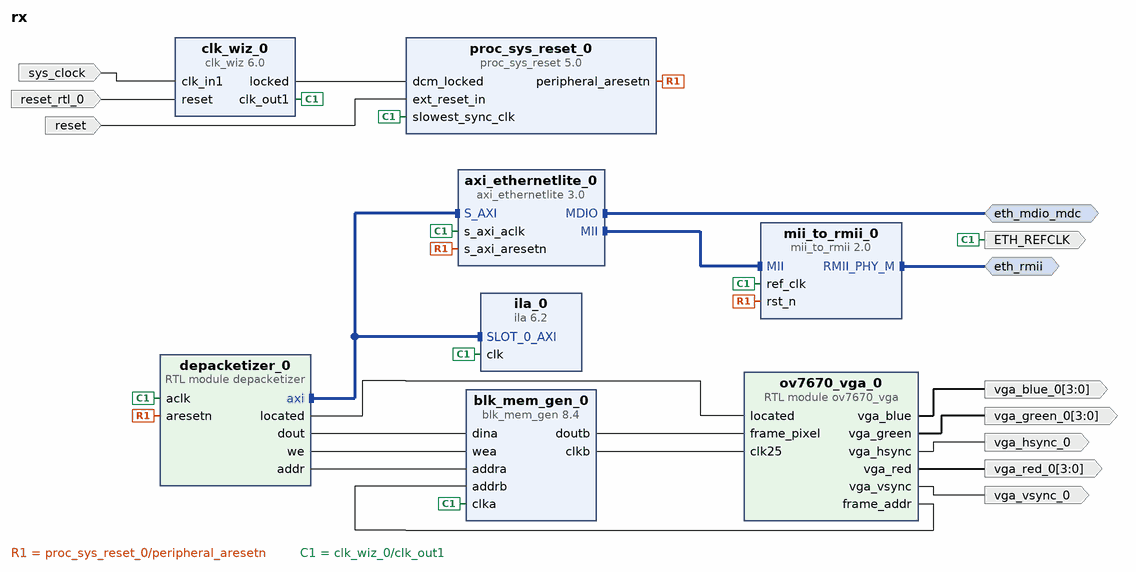
[diagram p0: block diagram of the top level]
# Vivado block design rx, xc7a100tcsg324-1, Vivado 2018.3
create_bd_design rx

create_bd_intf_port -mode Master -vlnv xilinx.com:interface:mdio_rtl:1.0 eth_mdio_mdc
create_bd_intf_port -mode Master -vlnv xilinx.com:interface:rmii_rtl:1.0 eth_rmii
create_bd_port -dir I -type rst reset
set_property -dict {CONFIG.POLARITY ACTIVE_LOW} [get_bd_ports reset]
create_bd_port -dir I -type clk sys_clock
set_property -dict {CONFIG.FREQ_HZ 100000000 CONFIG.PHASE 0.000} [get_bd_ports sys_clock]
create_bd_port -dir O -type clk ETH_REFCLK
create_bd_port -dir O -from 3 -to 0 vga_blue_0
create_bd_port -dir O -from 3 -to 0 vga_green_0
create_bd_port -dir O vga_hsync_0
create_bd_port -dir O -from 3 -to 0 vga_red_0
create_bd_port -dir O vga_vsync_0
create_bd_port -dir I -type rst reset_rtl_0
set_property -dict {CONFIG.POLARITY ACTIVE_HIGH} [get_bd_ports reset_rtl_0]

create_bd_cell -type ip -vlnv xilinx.com:ip:ila:6.2 ila_0
set_property -dict {CONFIG.C_NUM_OF_PROBES 19 CONFIG.C_SLOT_0_AXI_PROTOCOL AXI4LITE} [get_bd_cells ila_0]
create_bd_cell -type ip -vlnv xilinx.com:ip:blk_mem_gen:8.4 blk_mem_gen_0
set_property -dict [list \
  CONFIG.Enable_32bit_Address false \
  CONFIG.Enable_A Always_Enabled \
  CONFIG.Enable_B Always_Enabled \
  CONFIG.Fill_Remaining_Memory_Locations true \
  CONFIG.Memory_Type Simple_Dual_Port_RAM \
  CONFIG.Operating_Mode_A NO_CHANGE \
  CONFIG.Port_B_Clock 100 \
  CONFIG.Port_B_Enable_Rate 100 \
  CONFIG.Read_Width_B 12 \
  CONFIG.Register_PortB_Output_of_Memory_Primitives true \
  CONFIG.Use_Byte_Write_Enable false \
  CONFIG.Write_Depth_A 262144 \
  CONFIG.Write_Width_A 12 \
  CONFIG.Write_Width_B 12 \
  CONFIG.use_bram_block Stand_Alone \
] [get_bd_cells blk_mem_gen_0]
create_bd_cell -type module -reference depacketizer depacketizer_0
create_bd_cell -type ip -vlnv xilinx.com:ip:axi_ethernetlite:3.0 axi_ethernetlite_0
set_property -dict [list \
  CONFIG.C_RX_PING_PONG 0 \
  CONFIG.C_TX_PING_PONG 0 \
  CONFIG.MDIO_BOARD_INTERFACE Custom \
  CONFIG.USE_BOARD_FLOW true \
] [get_bd_cells axi_ethernetlite_0]
create_bd_cell -type ip -vlnv xilinx.com:ip:clk_wiz:6.0 clk_wiz_0
create_bd_cell -type ip -vlnv xilinx.com:ip:mii_to_rmii:2.0 mii_to_rmii_0
set_property -dict {CONFIG.RMII_BOARD_INTERFACE Custom} [get_bd_cells mii_to_rmii_0]
create_bd_cell -type ip -vlnv xilinx.com:ip:proc_sys_reset:5.0 proc_sys_reset_0
create_bd_cell -type module -reference ov7670_vga ov7670_vga_0

# ---- connections ----

connect_bd_intf_net [get_bd_intf_pins axi_ethernetlite_0/MII] [get_bd_intf_pins mii_to_rmii_0/MII]
connect_bd_intf_net [get_bd_intf_ports eth_rmii] [get_bd_intf_pins mii_to_rmii_0/RMII_PHY_M]
connect_bd_intf_net [get_bd_intf_ports eth_mdio_mdc] [get_bd_intf_pins axi_ethernetlite_0/MDIO]
connect_bd_intf_net [get_bd_intf_pins depacketizer_0/axi] [get_bd_intf_pins axi_ethernetlite_0/S_AXI]
connect_bd_intf_net [get_bd_intf_pins depacketizer_0/axi] [get_bd_intf_pins ila_0/SLOT_0_AXI]
connect_bd_net [get_bd_ports reset] [get_bd_pins proc_sys_reset_0/ext_reset_in]
connect_bd_net [get_bd_pins clk_wiz_0/locked] [get_bd_pins proc_sys_reset_0/dcm_locked]
connect_bd_net -net proc_sys_reset_0_peripheral_reset [get_bd_pins proc_sys_reset_0/peripheral_aresetn] \
  [get_bd_pins depacketizer_0/aresetn] [get_bd_pins axi_ethernetlite_0/s_axi_aresetn] [get_bd_pins mii_to_rmii_0/rst_n]
connect_bd_net -net clk_wiz_0_clk_100 [get_bd_pins clk_wiz_0/clk_out1] \
  [get_bd_pins ila_0/clk] [get_bd_pins blk_mem_gen_0/clka] [get_bd_pins depacketizer_0/aclk] \
  [get_bd_pins axi_ethernetlite_0/s_axi_aclk] [get_bd_ports ETH_REFCLK] [get_bd_pins mii_to_rmii_0/ref_clk] \
  [get_bd_pins proc_sys_reset_0/slowest_sync_clk]
connect_bd_net [get_bd_ports sys_clock] [get_bd_pins clk_wiz_0/clk_in1]
connect_bd_net [get_bd_pins blk_mem_gen_0/doutb] [get_bd_pins ov7670_vga_0/frame_pixel]
connect_bd_net [get_bd_pins ov7670_vga_0/frame_addr] [get_bd_pins blk_mem_gen_0/addrb]
connect_bd_net [get_bd_pins blk_mem_gen_0/clkb] [get_bd_pins ov7670_vga_0/clk25]
connect_bd_net [get_bd_pins ov7670_vga_0/vga_blue] [get_bd_ports vga_blue_0]
connect_bd_net [get_bd_pins ov7670_vga_0/vga_green] [get_bd_ports vga_green_0]
connect_bd_net [get_bd_pins ov7670_vga_0/vga_hsync] [get_bd_ports vga_hsync_0]
connect_bd_net [get_bd_pins ov7670_vga_0/vga_red] [get_bd_ports vga_red_0]
connect_bd_net [get_bd_pins ov7670_vga_0/vga_vsync] [get_bd_ports vga_vsync_0]
connect_bd_net [get_bd_pins depacketizer_0/located] [get_bd_pins ov7670_vga_0/located]
connect_bd_net [get_bd_pins depacketizer_0/dout] [get_bd_pins blk_mem_gen_0/dina]
connect_bd_net [get_bd_pins depacketizer_0/we] [get_bd_pins blk_mem_gen_0/wea]
connect_bd_net [get_bd_pins depacketizer_0/addr] [get_bd_pins blk_mem_gen_0/addra]
connect_bd_net -net reset_rtl_0_1 [get_bd_ports reset_rtl_0] [get_bd_pins clk_wiz_0/reset]

# ---- address map ----
assign_bd_address -offset 0x0000 -range 8K -target_address_space [get_bd_addr_spaces depacketizer_0/axi] [get_bd_addr_segs axi_ethernetlite_0/S_AXI/Reg]

validate_bd_design
save_bd_design
